# Altium schematic sheet TK525_Hovedstrom.SchDoc: TK525 Hovedstrøm
size A3; Author: Øystein Smith; Organization: Omega Verksted; DocumentNumber: 14; Revision: 0; SheetNumber: 14; SheetTotal: 20
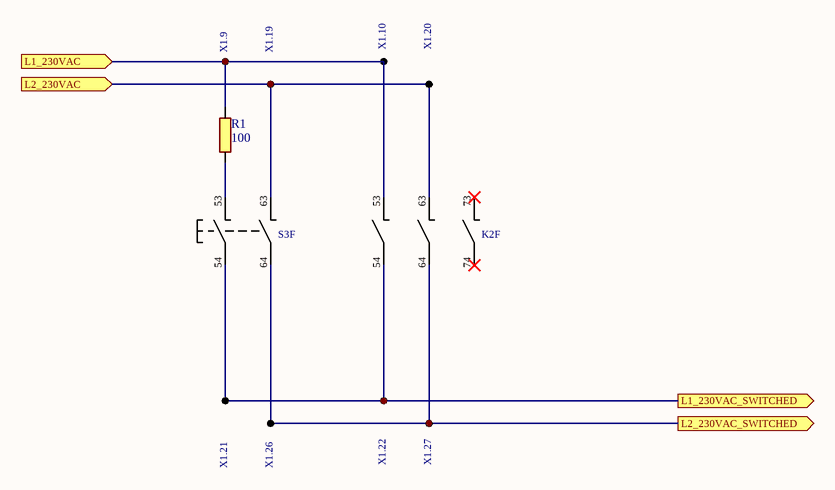
[diagram p0: TK525_Hovedstrom.SchDoc]

## Parts
K2  Kontaktor  (value not drawn)  (part F of 6)
R1  100  [RESA_0.25W]
S3  Automasjonsbryter  (value not drawn)  (parts E,F,G of 10)
X1.9  Rekkeklemme 2.5mm2  (value not drawn)
X1.10  Rekkeklemme 2.5mm2  (value not drawn)
X1.19  Rekkeklemme 2.5mm2  (value not drawn)
X1.20  Rekkeklemme 2.5mm2  (value not drawn)
X1.21  Rekkeklemme 2.5mm2  (value not drawn)
X1.22  Rekkeklemme 2.5mm2  (value not drawn)
X1.26  Rekkeklemme 2.5mm2  (value not drawn)
X1.27  Rekkeklemme 2.5mm2  (value not drawn)

## Ports
L1_230VAC (in), L1_230VAC_SWITCHED (out), L2_230VAC (in), L2_230VAC_SWITCHED (out)

## Nets
L1_230VAC: K2.53 R1.2 ; port L1_230VAC
L1_230VAC_SWITCHED: K2.54 S3.54 ; port L1_230VAC_SWITCHED
L2_230VAC: K2.63 S3.63 ; port L2_230VAC
L2_230VAC_SWITCHED: K2.64 S3.64 ; port L2_230VAC_SWITCHED
NetR1_1: R1.1 S3.53

Not connected (* = marked no-connect by the designer): K2 73* 74*

## Notes on the sheet
- Size:
- Date:
- Title:
- A3
- Revision:
- Sheet
- of
- Author:
- File:

## Library data of the parts
K2 = 3181: Industriellt rele; symbol_opprettet_av: 815; pris: 50; id: 3181; navn: Kontaktor; symbol_opprettet: 04.07.2015 12:23:41; nokkelord: Contactor; pakketype: -
R1 = 2783: 0.25W 1% Generic resistor; id: 2783; rad: 3; rom: OV; lager_type: Fremlager; dybde: 0; hylle: 8; pakke_opprettet_av: 815; symbol_opprettet_av: oystesm; nokkelord: Motstand, Resistor; pakketype: 92; antall: 100; kolonne: 0; pakke_opprettet: 28.06.2014 17:13:33; symbol_opprettet: 08.07.2014 21:16:33; navn: 100; pris: 0
S3 = 3182: Kraftig; symbol_opprettet_av: 815; pris: 100; id: 3182; navn: Automasjonsbryter; symbol_opprettet: 05.07.2015 13:10:20; pakketype: -
X1.9 X1.10 X1.19-X1.22 X1.26 X1.27 = 4059: DIN Rail mount terminal block; id: 4059; symbol_opprettet_av: 815; leverandor_varenr: 2061376; pris: 5; nokkelord: CDU2.5; produsent: Multicomp; leverandor: Farnell; symbol_opprettet: 3/12/2017 12:15:42 AM; navn: Rekkeklemme 2.5mm2; pakketype: -